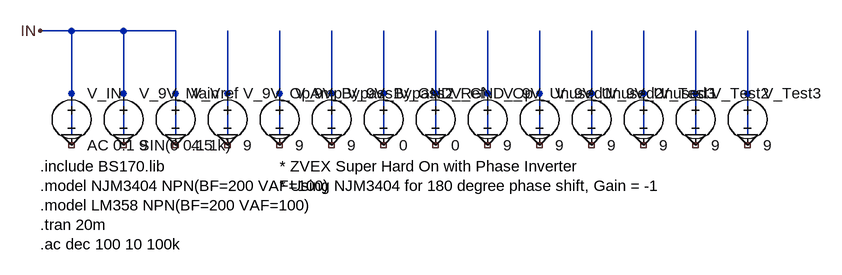
[diagram p0: schematic SHO_PhaseReverse.asc]
SHO_PhaseReverse.asc, the LTspice schematic file:
Version 4
SHEET 1 1400 800
WIRE 80 32 32 32
WIRE 160 32 80 32
WIRE 240 32 160 32
WIRE 320 64 320 32
WIRE 400 64 400 32
WIRE 480 64 480 32
WIRE 560 64 560 32
WIRE 640 64 640 32
WIRE 720 64 720 32
WIRE 800 64 800 32
WIRE 880 64 880 32
WIRE 960 64 960 32
WIRE 1040 64 1040 32
WIRE 1120 64 1120 32
WIRE 80 128 80 32
WIRE 160 128 160 32
WIRE 240 128 240 32
WIRE 320 128 320 64
WIRE 400 128 400 64
WIRE 480 128 480 64
WIRE 560 128 560 64
WIRE 640 128 640 64
WIRE 720 128 720 64
WIRE 800 128 800 64
WIRE 880 128 880 64
WIRE 960 128 960 64
WIRE 1040 128 1040 64
WIRE 1120 128 1120 64
WIRE 80 192 80 128
WIRE 160 192 160 128
WIRE 240 192 240 128
WIRE 320 192 320 128
WIRE 400 192 400 128
WIRE 480 192 480 128
WIRE 560 192 560 128
WIRE 640 192 640 128
WIRE 720 192 720 128
WIRE 800 192 800 128
WIRE 880 192 880 128
WIRE 960 192 960 128
WIRE 1040 192 1040 128
WIRE 1120 192 1120 128
FLAG 32 32 IN
FLAG 80 192 0
FLAG 160 192 0
FLAG 240 192 0
FLAG 320 192 0
FLAG 400 192 0
FLAG 480 192 0
FLAG 560 192 0
FLAG 640 192 0
FLAG 720 192 0
FLAG 800 192 0
FLAG 880 192 0
FLAG 960 192 0
FLAG 1040 192 0
FLAG 1120 192 0
SYMBOL voltage 80 112 R0
SYMATTR InstName V_IN
SYMATTR Value AC 0.1 SIN(0 0.1 1k)
SYMBOL voltage 160 112 R0
SYMATTR InstName V_9V_Main
SYMATTR Value 9
SYMBOL voltage 240 112 R0
SYMATTR InstName V_Vref
SYMATTR Value 4.5
SYMBOL voltage 320 112 R0
SYMATTR InstName V_9V_OpAmp
SYMATTR Value 9
SYMBOL voltage 400 112 R0
SYMATTR InstName V_9V_Bypass1
SYMATTR Value 9
SYMBOL voltage 480 112 R0
SYMATTR InstName V_9V_Bypass2
SYMATTR Value 9
SYMBOL voltage 560 112 R0
SYMATTR InstName V_GND_Ref
SYMATTR Value 0
SYMBOL voltage 640 112 R0
SYMATTR InstName V_GND_Op
SYMATTR Value 0
SYMBOL voltage 720 112 R0
SYMATTR InstName V_9V_Unused1
SYMATTR Value 9
SYMBOL voltage 800 112 R0
SYMATTR InstName V_9V_Unused2
SYMATTR Value 9
SYMBOL voltage 880 112 R0
SYMATTR InstName V_9V_Unused3
SYMATTR Value 9
SYMBOL voltage 960 112 R0
SYMATTR InstName V_Test1
SYMATTR Value 9
SYMBOL voltage 1040 112 R0
SYMATTR InstName V_Test2
SYMATTR Value 9
SYMBOL voltage 1120 112 R0
SYMATTR InstName V_Test3
SYMATTR Value 9
TEXT 32 240 Left 2 !.include BS170.lib
TEXT 32 270 Left 2 !.model NJM3404 NPN(BF=200 VAF=100)
TEXT 32 300 Left 2 !.model LM358 NPN(BF=200 VAF=100)
TEXT 32 330 Left 2 !.tran 20m
TEXT 32 360 Left 2 !.ac dec 100 10 100k
TEXT 400 240 Left 2 !* ZVEX Super Hard On with Phase Inverter
TEXT 400 270 Left 2 !* Using NJM3404 for 180 degree phase shift, Gain = -1

The netlist it stands for:
* SHO_PhaseReverse.asc
V_IN 0 NC_01 AC 0.1 SIN(0 0.1 1k)
V_9V_Main 0 NC_02 9
V_Vref 0 NC_03 4.5
V_9V_OpAmp 0 NC_04 9
V_9V_Bypass1 0 NC_05 9
V_9V_Bypass2 0 NC_06 9
V_GND_Ref 0 NC_07 0
V_GND_Op 0 NC_08 0
V_9V_Unused1 0 NC_09 9
V_9V_Unused2 0 NC_10 9
V_9V_Unused3 0 NC_11 9
V_Test1 0 NC_12 9
V_Test2 0 NC_13 9
V_Test3 0 NC_14 9
.include BS170.lib
.model NJM3404 NPN(BF=200 VAF=100)
.model LM358 NPN(BF=200 VAF=100)
.tran 20m
.ac dec 100 10 100k
* ZVEX Super Hard On with Phase Inverter
* Using NJM3404 for 180 degree phase shift, Gain = -1
.backanno
.end